# Altium schematic sheet Communication & Display.SchDoc
size A4; SheetNumber: 4; SheetTotal: 4
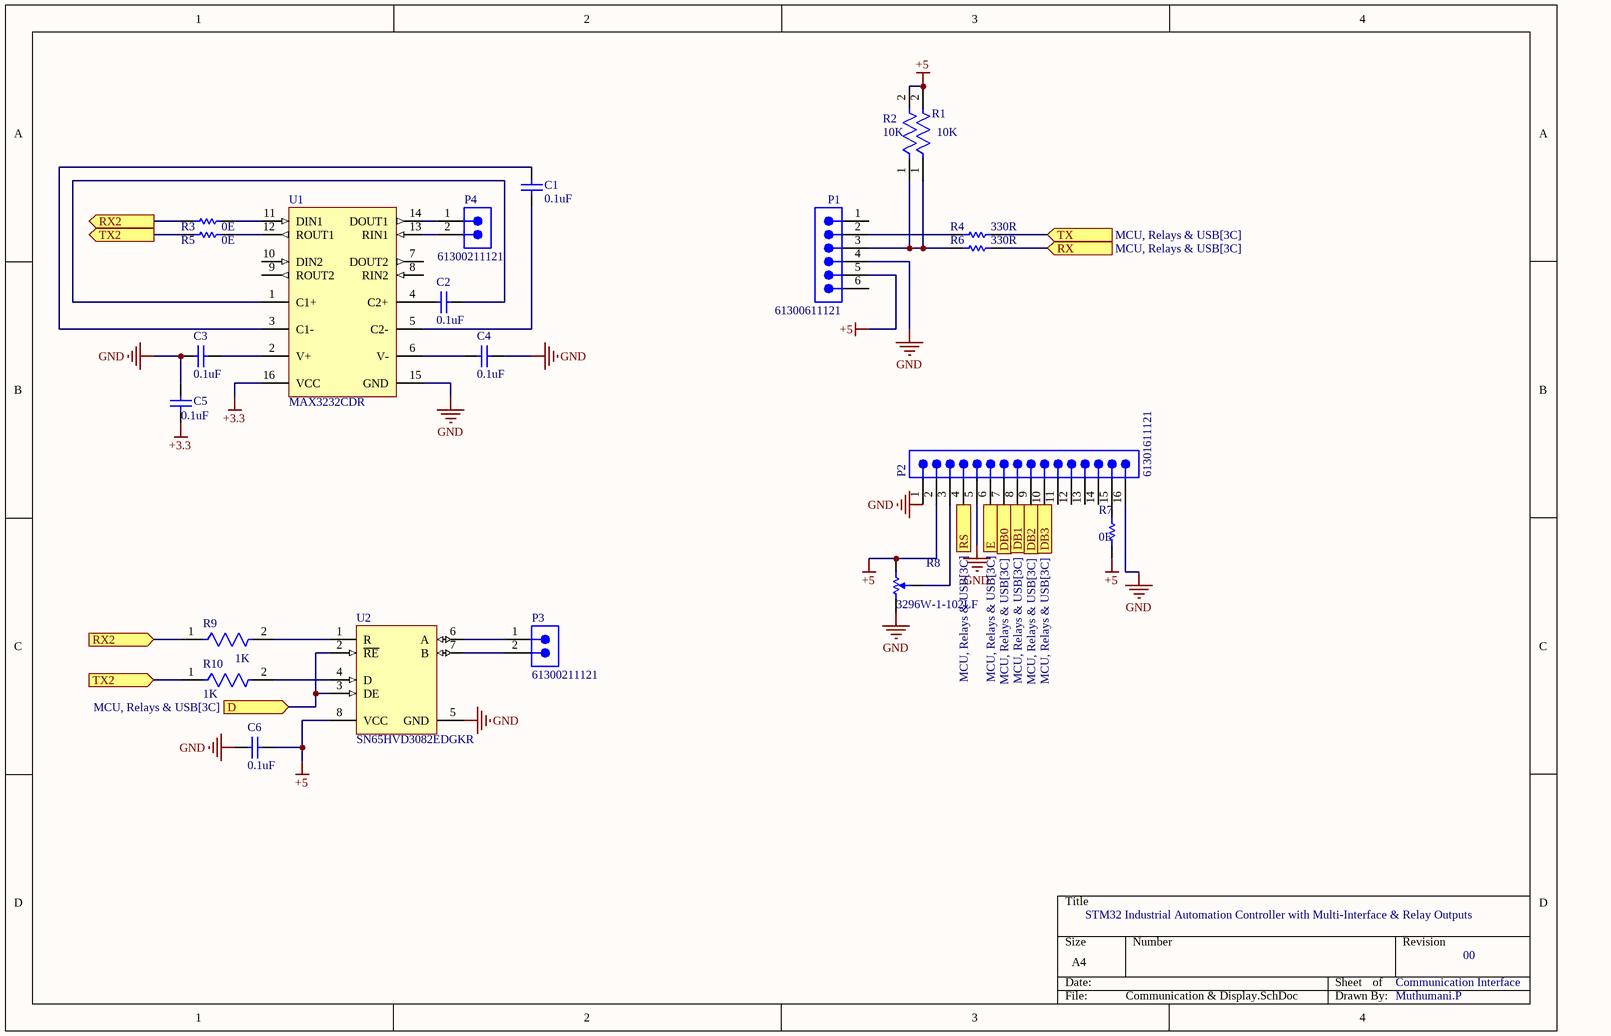
[diagram p0: Communication & Display.SchDoc]

## Parts
C1  0.1uF  [CAPC1608X90X35ML10T15]
C2  0.1uF  [CAPC1608X90X35ML10T15]
C3  0.1uF  [CAPC1608X90X35ML10T15]
C4  0.1uF  [CAPC1608X90X35ML10T15]
C5  0.1uF  [CAPC1608X90X35ML10T15]
C6  0.1uF  [CAPC1608X90X35ML10T15]
P1  61300611121  [61300611121]
P2  61301611121  [61301611121]
P3  61300211121  [61300211121]
P4  61300211121  [61300211121]
R1  10K  [FP-RC0603-0_55-IPC_C]
R2  10K  [FP-RC0603-0_55-IPC_C]
R3  0E  [RESC1608X55X25ML10T15]
R4  330R  [RESC1608X55X25NL10T15]
R5  0E  [RESC1608X55X25ML10T15]
R6  330R  [RESC1608X55X25NL10T15]
R7  0E  [RESC1608X55X25ML10T15]
R8  3296W-1-102LF  [BOUR-3296W-1-3]
R9  1K  [FP-RC0603-0_55-IPC_C]
R10  1K  [FP-RC0603-0_55-IPC_C]
U1  MAX3232CDR  [D0016A_L]
U2  SN65HVD3082EDGKR  [DGK0008A_M]

## Ports
D (in, see MCU, Relays & USB[3C]), DB0 (see MCU, Relays & USB[3C]), DB1 (see MCU, Relays & USB[3C]), DB2 (see MCU, Relays & USB[3C]), DB3 (see MCU, Relays & USB[3C]), E (see MCU, Relays & USB[3C]), RS (see MCU, Relays & USB[3C]), RX2 (in, see Communication & Display[1A], MCU, Relays & USB[3C]), RX2 (out, see Communication & Display[1C], MCU, Relays & USB[3C]), RX (in, see MCU, Relays & USB[3C]), TX2 (in, see Communication & Display[1A], MCU, Relays & USB[3C]), TX2 (out, see Communication & Display[1C], MCU, Relays & USB[3C]), TX (in, see MCU, Relays & USB[3C])

## Nets
+3.3: C5.2 U1.16(VCC)
+5: C6.1 P1.5 P2.2 R1.2 R2.2 R7.1 R8.2(B) U2.8(VCC)
GND: C3.2 C4.2 C5.1 C6.2 P1.4 P2.1 P2.5 P2.16 R8.1(A) U1.15(GND) U2.5(GND)
D: U2.2(~{RE}) U2.3(DE) ; port D
DB0: P2.7 ; port DB0
DB1: P2.8 ; port DB1
DB2: P2.9 ; port DB2
DB3: P2.10 ; port DB3
E: P2.6 ; port E
RS: P2.4 ; port RS
RX: R6.2 ; port RX
RX2: R3.1 R9.1 ; port RX2
TX: R4.2 ; port TX
TX2: R5.1 R10.1 ; port TX2
NetC1_1: C1.1 U1.5(C2-)
NetC1_2: C1.2 U1.3(C1-)
NetC2_1: C2.1 U1.4(C2+)
NetC2_2: C2.2 U1.1(C1+)
NetC3_1: C3.1 U1.2(V+)
NetC4_1: C4.1 U1.6(V-)
NetP1_2: P1.2 R4.1
NetP1_3: P1.3 R1.1 R2.1 R6.1
NetP2_3: P2.3 R8.3(TAP)
NetP2_15: P2.15 R7.2
NetP3_1: P3.1 U2.6(A)
NetP3_2: P3.2 U2.7(B)
NetP4_1: P4.1 U1.14(DOUT1)
NetP4_2: P4.2 U1.13(RIN1)
NetR3_2: R3.2 U1.11(DIN1)
NetR5_2: R5.2 U1.12(ROUT1)
NetR9_2: R9.2 U2.1(R)
NetR10_2: R10.2 U2.4(D)

Not connected (* = marked no-connect by the designer): P1 1 6; P2 11 12 13 14; U1 7(DOUT2) 8(RIN2) 9(ROUT2) 10(DIN2)

## Notes on the sheet
- STM32 Industrial Automation Controller with Multi-Interface & Relay Outputs
- Communication Interface
- 00
- Muthumani.P

## Library data of the parts
C1-C6 = CMP-2100-03643-1: Chip Capacitor, 0.1 uF, +/- 10%, 50 V, -55 to 125 degC, 0603 (1608 Metric), RoHS, Tape and Reel; Manufacturer: Murata; Dielectric Material: Ceramic; Voltage Rating: 50V; Capacitance: 100nF; Dielectric: X7R; Insulation Resistance: 10GR; Case Code (Metric): 1608; Lead Free: LeadFree; Depth: 0.8mm; Number of Pins: 2; Radiation Hardening: No; Case/Package: 0603; Manufacturer URL: http://www.murata.com/; Packaging: TapeandReel; Length: 1.6mm; Contact Plating: Tin; Datasheet URL: http://psearch.en.murata.com/capacitor/product/GRM188R71H104KA93%23.pdf; Tolerance: 10%; Case Code (Imperial): 0603; Min Operating Temperature: -55degC; RoHSCompliant: true; Voltage: 50V; Termination: SMD/SMT; Mount: SurfaceMount; Material: Ceramic; Package Quantity: 1; Height: 0.8mm; Thickness: 0.035inch; REACH SVHC: NoSVHC; Max Operating Temperature: 125degC; Width: 0.8mm; Package Reference: 0603; Voltage Rating (DC): 50V; Datasheet Version: 42675.0; Package Description: 2-Pin Surface Mount Device, Body 1.6 x 0.8 mm
P1 = CMP-1502-01070-4: THT Vertical Pin Header WR-PHD, Pitch 2.54 mm, Single Row, 6 pins; Pitch: 2.54mm; Operating Supply Voltage: 250V; Connector Type: Male Pin; Gender: Male; Number of Positions: 6; Contact Resistance: 20mΩ; Current Rating: 3A; Termination: Through Hole; Color: Black; Number of Pins: 6; Lead Pitch: 2.54mm; Height: 8.89mm; RoHS: Compliant; Lead Free: Lead Free; Contact Mating Length: 5.9944mm; Contact Plating: Gold; Contact Gender: Male; Packaging: Bulk; Orientation: Vertical; Mount: Through Hole; Voltage Rating: 250V; Number of Rows: 1; Max Operating Temperature: 105°C; Min Operating Temperature: -40°C; Housing Material: PBT; Contact Material: Gold; Number of Contacts: 6
P2 = CMP-1502-01095-5: THT Vertical Pin Header WR-PHD, Pitch 2.54 mm, Single Row, 16 pins; Connector Type: Male Pin; Contact Resistance: 20mΩ; Number of Contacts: 16; Pitch: 2.54mm; Gender: Male; Voltage Rating: 250V; Current Rating: 3A; Contact Material: Gold; Min Operating Temperature: -40°C; Height: 8.89mm; Termination: Solder; Mount: Through Hole; Max Operating Temperature: 105°C; Number of Rows: 1; Color: Black; Contact Mating Length: 5.9944mm; Orientation: Vertical; Operating Supply Voltage: 250V; RoHS: Compliant; Packaging: Bulk; Number of Pins: 16; Lead Pitch: 2.54mm; Contact Plating: Gold; Number of Positions: 16
P3 P4 = CMP-1712-00002-7: THT Vertical Pin Header WR-PHD, Pitch 2.54 mm, Single Row, 2 pins; Pitch: 2.54mm; Number of Contacts: 2; Connector Type: Male Pin; Gender: Male; Contact Resistance: 20mΩ; Operating Supply Voltage: 250V; Current Rating: 3A; Housing Material: PBT; RoHS: Compliant; Lead Free: Lead Free; Contact Material: Gold; REACH SVHC: No; Min Operating Temperature: -40°C; Termination: Through Hole; Number of Pins: 2; Contact Gender: Male; Packaging: Bulk; Lead Pitch: 2.54mm; Contact Plating: Gold; Orientation: Vertical; Mount: Through Hole; Height: 8.94mm; Color: Black; Number of Positions: 2; Contact Mating Length: 5.9944mm; Max Operating Temperature: 105°C; Voltage Rating: 250V; Number of Rows: 1
R1 R2 = CMP-2100-03664-2: RES 10K OHM 1% 1/10W 0603; Voltage Rating: 75V; Voltage Rating (DC): 50V; Resistance: 10kR; Power Rating: 100mW; Temperature Coefficient: 100ppm/°C; Depth: 0.8mm; Termination: SMD/SMT; Resistor Type: Thick Film; Series: RC; Construction: Rectangular; Features: Moisture Resistant; Packaging: Tape and Reel; Min Operating Temperature: -55°C; Number of Terminations: 2; Lead Pitch: 0.3mm; RoHS Compliant: Yes; Case/Package: 0603; Resistance Tolerance: 1%; Military Standard: Not; Weight: 7.1E-05oz; Number of Pins: 2; Tolerance: 1%; Length: 1.6mm; Case Code (Imperial): 0603; Lead Free: Lead Free; Width: 0.8mm; Max Power Dissipation: 100mW; Height: 0.45mm; Max Operating Temperature: 155°C; Case Code (Metric): 1608; Size Code: 0603
R3 R5 R7 = CMP-2100-03667-1: Chip Resistor, 0 Ohm, +/- 5%, 0.1 W, -55 to 155 degC, 0603 (1608 Metric), RoHS, Tape and Reel; Manufacturer: Yageo; Temperature Coefficient: 200ppm/degreesC; Voltage Rating: 50V; Power Rating: 100mW; Resistance: 0mOhm; Width: 0.8mm; Max Operating Temperature: 155degC; Tolerance: 5%; Package Reference: 0603; Height: 0.45mm; Depth: 0.8mm; Package Description: 2-Pin Surface Mount Device, Body 1.6 x 0.8 mm; Termination: SMD/SMT; Package Quantity: 5000; Case/Package: 0603; Case Code (Imperial): 0603; Radiation Hardening: No; Number of Pins: 2; Length: 1.6mm; Lead Free: LeadFree; Voltage Rating (DC): 50V; Military Standard: Not; Datasheet URL: http://www.yageo.com/NewPortal/yageodocoutput?fileName=/pdf/R-Chip/PYu-RC_Group_51_RoHS_L_5.pdf; Manufacturer URL: http://www.yageo.com/; Packaging: TapeandReel; Case Code (Metric): 1608; Min Operating Temperature: -55degC; Composition: ThickFilm; RoHSCompliant: true; Contact Plating: Tin; Datasheet Version: Rev. 5, 10/2016; REACH SVHC: NoSVHC
R4 R6 = CMP-1659-00020-2: Chip Resistor, 330 Ohm, +/- 1%, 0.1 W, -55 to 155 degC, 0603 (1608 Metric), RoHS, Tape and Reel; Tolerance: 10%; ESR: 800 mohm; Voltage Rating (DC): 16 V; Capacitance: 47 uF; Length: 7.3 mm; ComponentLink1URL: http://www.yageo.com/; Packaging: Tape and Reel; Pins: 2; ComponentLink1Description: Manufacturer URL; Case Code (Imperial): 2917; REACH SVHC: No SVHC; Width: 4.3 mm; ComponentLink2Description: Datasheet; Voltage Rating: 16 V; RoHSCompliant: True; Max Operating Temperature: 125degC; ComponentLink2URL: http://www.yageo.com/documents/recent/PYu-RC_Group_51_RoHS_L_04.pdf; Min Operating Temperature: -55degC; Case/Package: 2917; Radiation Hardening: No; DatasheetVersion: Rev. 4, 02/2016; Mount: Surface Mount; PackageReference: 0603; Package Quantity: 500; Case Code (Metric): 7343; PackageDescription: 2-Pin Surface Mount Device, Body 1.6 x 0.8 mm; Height: 3.1 mm
R8 = CMP-1747-00002-1: Square Trimpot(R) Trimming Potentiometer, 1000 Ohm, -55 to 125 degC, 3-Pin THD, RoHS, Tube; Case\Package: 0603; Tolerance: 1%; Power Rating: 100 mW; Voltage Rating: 75 V; Resistance: 4.7 kohm; ComponentLink2URL: http://www.bourns.com/docs/Product-Datasheets/3296.pdf; Packaging: Tape and Reel; REACH SVHC: Yes; ComponentLink1URL: http://www.bourns.com/; Case Code (Metric): 1608; Width: 0.8 mm; ComponentLink1Description: Manufacturer URL; DatasheetVersion: May-16; Max Operating Temperature: 155 degC; PackageReference: 3296W-1-3; PackageDescription: 3-Pin Through Hole Device, Body 9.53 x 4.83 mm, Pitch 2.54 mm; Weight: 7.1E-05 oz; ComponentLink2Description: Datasheet; RoHSCompliant: true; Min Operating Temperature: -55 degC; Radiation Hardening: No; Case Code (Imperial): 0603; Length: 1.6 mm; Package Quantity: 5000; Pins: 2; Mount: Surface Mount; Height: 0.45 mm
R9 R10 = CMP-1659-00009-5: RES 1K OHM 1% 1/10W 0603; Resistance: 1kR; Voltage Rating: 50V; Power Rating: 100mW; Temperature Coefficient: 100ppm/°C; Military Standard: Not; REACH SVHC: No SVHC; Size Code: 0603; Features: Moisture Resistant; Number of Terminations: 2; Technology: THICK FILM; Series: RC; Case Code (Metric): 1608; Resistance Tolerance: 1%; Resistor Type: Thick Film; Termination: SMD/SMT; Contact Plating: Tin; Radiation Hardening: No; Min Operating Temperature: -55°C; Max Operating Temperature: 155°C; Packaging: Tape and Reel; Max Power Dissipation: 100mW; RoHS Compliant: Yes; Height: 0.45mm; Lead Free: Lead Free; Case/Package: 0603; Length: 1.6mm; Tolerance: 1%; Case Code (Imperial): 0603; Construction: Rectangular; Depth: 0.8mm
U1 = CMP-0299-00399-2: 3-V to 5.5-V Multichannel RS-232 Line Driver / Receiver with ±15-kV ESD Protection, 0 to 70 degC, 16-Pin SOIC (D), Green (RoHS & no Sb/Br); Receivers Per Package: 2; ESD HBM(kV): +/-15; ICC(Max)(mA): 1; Supply Voltage(s)(V): 3.3 or 5.0; Single Supply: TRUE; ComponentLink1URL: www.ti.com; ComponentLink3URL: http://www.ti.com/litv/pdf/mpds178g; PackageReference: D0016A; ComponentLink2Description: Datasheet; ComponentLink2URL: http://www.ti.com/general/docs/lit/getliterature.tsp?genericPartNumber=MAX3232&fileType=pdf; ComponentLink1Description: Manufacturer URL; PackageDescription: 16-Pin Plastic Small Outline Integrated Circuit, 9.9 x 3.9 mm, Pitch 1.27 mm Pitch; PackageVersion: revM, Jun-2011; Drivers Per Package: 2; SubFamily: RS-232; DatasheetVersion: SLLS410I; ComponentLink3Description: Package Specification; RS-232: TRUE
U2 = CMP-0316-00103-2: Low-Power RS-485 Transceiver, 0.2 Mbps, 5 V, Half Duplex, -40 to 85 degC, 8-pin MSOP (DGK), Green (RoHS & no Sb/Br); Manufacturer: Texas Instruments; ESD(kV): 15; Supply Voltage(s)(V): 5; # of TX/RX: 1 TX / 1 RX; Receivers Per Package: 1; Fault Protection(V): -9 to 14; Common Mode Range: -7 to 12; ICC(Max)(mA): 0.9; Fail Safe: Idle, Open, Short; Rating: Catalog; Number of Nodes: 256; Signaling Rate(Mbps): 0.2; Footprint: SN75176; PackageDescription: 8-Pin Thin Small Outline Package 3 x 3 mm Body ,0.65 mm Pitch; PartNumber: SN65HVD3082EDGKR; ComponentLink2Description: Package Specification; Code_JEDEC: MO-187-AA; ComponentLink1URL: http://www.ti.com/general/docs/lit/getliterature.tsp?genericPartNumber=SN65HVD3082E&fileType=pdf; Drivers Per Package: 1; Eco-Plan: Green (RoHS & no Sb/Br); PackageReference: DGK0008A; Isolated: No; DatasheetVersion: SLLS562G; SubFamily: RS-485; Duplex: Half; ComponentLink1Description: Datasheet; ComponentLink2URL: http://www.ti.com/litv/pdf/msoi002j; Mounting Technology: Surface Mount; PackageVersion: revE, May-2006